# Altium schematic sheet Schematic.SchDoc
size 381 x 241 mm
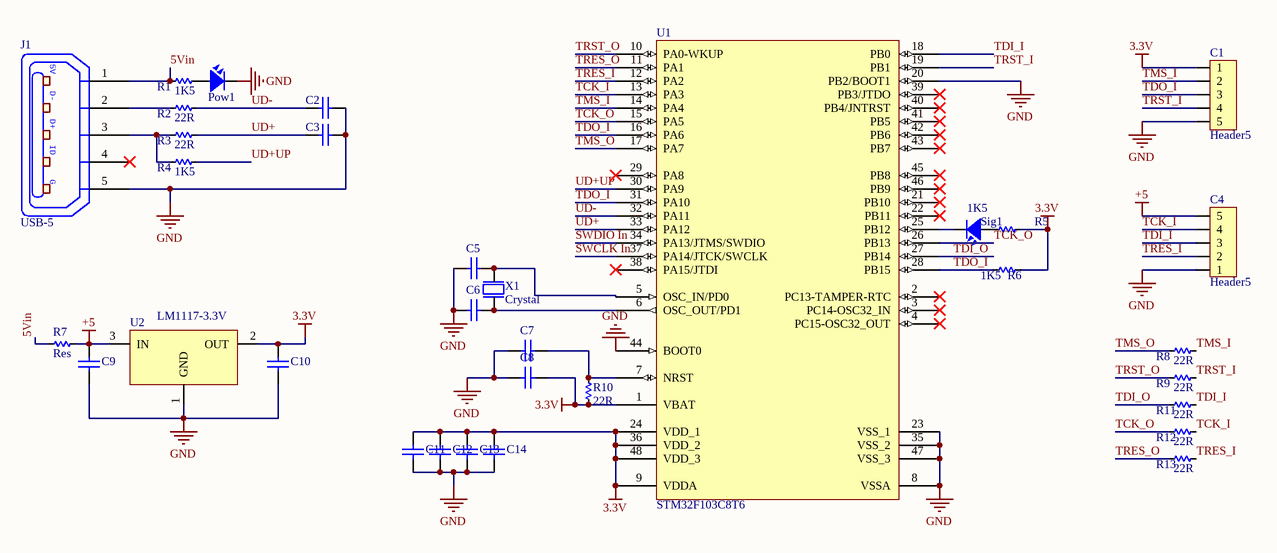
[diagram p0: Schematic.SchDoc]

## Parts
C1  Header5  [Header5 SMD]
C2  Capacitor Ceramic  [C0805]  (value not drawn)
C3  Capacitor Ceramic  [C0805]  (value not drawn)
C4  Header5  [Header5 SMD]
C5  Capacitor Ceramic  [C0805]  (value not drawn)
C6  Capacitor Ceramic  [C0805]  (value not drawn)
C7  Capacitor Ceramic  [C0805]  (value not drawn)
C8  Capacitor Ceramic  [C0805]  (value not drawn)
C9  Capacitor Ceramic  [C0805]  (value not drawn)
C10  Capacitor Ceramic  [C0805]  (value not drawn)
C11  Capacitor Ceramic  [C0805]  (value not drawn)
C12  Capacitor Ceramic  [C0805]  (value not drawn)
C13  Capacitor Ceramic  [C0805]  (value not drawn)
C14  Capacitor Ceramic  [C0805]  (value not drawn)
J1  USB-5  [USB-M1]
Pow1  LED  [LED-0805-Red]  (value not drawn)
R1  1K5  [RES-SMD-0603]
R2  22R  [RES-SMD-0603]
R3  22R  [RES-SMD-0603]
R4  1K5  [RES-SMD-0603]
R5  1K5  [RES-SMD-0603]
R6  1K5  [RES-SMD-0603]
R7  Res  [RES-SMD-1206]
R8  22R  [RES-SMD-0603]
R9  22R  [RES-SMD-0603]
R10  22R  [RES-SMD-0603]
R11  22R  [RES-SMD-0603]
R12  22R  [RES-SMD-0603]
R13  22R  [RES-SMD-0603]
Sig1  LED  [LED-0805-Red]  (value not drawn)
U1  STM32F103C8T6  [LQFP48_N]
U2  LM1117-3.3V  [SOT223]
X1  Crystal  [Crystal]

## Nets
3.3V: C1.1 C8.2 C10.1 C11.1 C12.1 C13.1 C14.1 R5.2 R6.2 R10.2 U1.1(VBAT) U1.9(VDDA) U1.24(VDD_1) U1.36(VDD_2) U1.48(VDD_3) U2.2(OUT)
+5: C4.5 C9.1 R7.1 U2.3(IN)
GND: C1.5 C2.1 C3.1 C4.1 C5.1 C6.1 C7.1 C8.1 C9.2 C10.2 C11.2 C12.2 C13.2 C14.2 J1.5(P5) Pow1.2 U1.8(VSSA) U1.20(PB2/BOOT1) U1.23(VSS_1) U1.35(VSS_2) U1.44(BOOT0) U1.47(VSS_3) U2.1(GND)
5Vin: J1.1(P1) R1.2 R7.2
SWCLK In: U1.37(PA14/JTCK/SWCLK)
SWDIO In: U1.34(PA13/JTMS/SWDIO)
TCK_I: C4.4 R12.1 U1.13(PA3)
TCK_O: R12.2 U1.15(PA5) U1.26(PB13)
TDI_I: C4.3 R11.1 U1.18(PB0)
TDI_O: R11.2 U1.27(PB14)
TDO_I: C1.3 R6.1 U1.16(PA6) U1.28(PB15) U1.31(PA10)
TMS_I: C1.2 R8.1 U1.14(PA4)
TMS_O: R8.2 U1.17(PA7)
TRES_I: C4.2 R13.1 U1.12(PA2)
TRES_O: R13.2 U1.11(PA1)
TRST_I: C1.4 R9.1 U1.19(PB1)
TRST_O: R9.2 U1.10(PA0-WKUP)
UD+: C3.2 R3.1 U1.33(PA12)
UD+UP: R4.1 U1.30(PA9)
UD-: C2.2 R2.1 U1.32(PA11)
NetC5_2: C5.2 U1.5(OSC_IN/PD0) X1.2
NetC6_2: C6.2 U1.6(OSC_OUT/PD1) X1.1
NetC7_2: C7.2 R10.1 U1.7(NRST)
NetJ1_2: J1.2(P2) R2.2
NetJ1_3: J1.3(P3) R3.2 R4.2
NetPow1_1: Pow1.1 R1.1
NetR5_1: R5.1 Sig1.1
NetSig1_2: Sig1.2 U1.25(PB12)

Not connected (* = marked no-connect by the designer): J1 4(P4)*; U1 2(PC13-TAMPER-RTC)* 3(PC14-OSC32_IN)* 4(PC15-OSC32_OUT)* 21(PB10)* 22(PB11)* 29(PA8)* 38(PA15/JTDI)* 39(PB3/JTDO)* 40(PB4/JNTRST)* 41(PB5)* 42(PB6)* 43(PB7)* 45(PB8)* 46(PB9)*

## Notes on the sheet
- (in symbol USB-5) 5V; D-; D+; ID; G

## Library data of the parts
C1 C4 = Header5: Header IDC, 5 x 1 Pin Vertical 2.54mm Pitch (Non-Boxed, Male); Manufacturer: W¨¹rth Elektronik eiSos GmbH; partNo: 613002143121; ComponentLink1 Description: Manufacturer; ComponentLink2 Description: Datasheet; NoPins: 02; Created Date: 29 March 2013; ComponentLink1URL: http://www.we-online.com; ComponentLink2URL: http://katalog.we-online.de/em/datasheet/6130xx143121.pdf; Created by: Karrer Zheng
C2 C3 C5-C14 = CapSMD: Capacitor; Value: 33p; Published: 8-Jun-2000; LatestRevisionDate: 17-Jul-2002; LatestRevisionNote: Re-released for DXP Platform.; PackageReference: RAD-0.3; Publisher: Altium Limited
J1 = USB-5: Manufacturer: FCI; Manufacturer Part Number: 10118193-0001LF; Connector Type: USB - micro B; Number of Contacts: 5; Gender: Receptacle; Specifications: USB 2.0; .Creator: MM; .Checked PCB: RF; Supplier 1: Digi-Key; RoHS: RoHS Compliant; Category: Connectors, Interconnects; Stock 1: 28642; Pricing 1: 1=0.46, 10=0.433, 25=0.3712, 50=0.3156, 100=0.3032, 250=0.27224, 500=0.25988 (USD); Packaging: Cut Tape (CT); Mounting Type: Surface Mount, Right Angle, Horizontal; Features: Shielded, Solder Retention; Ingress Protection: -; ComponentLink1URL: http://portal.fciconnect.com/Comergent//fci/drawing/10118193.pdf; ComponentLink1Description: http://portal.fciconnect.com/Comergent//fci/drawing/10118193.pdf; Supplier Part Number 1: 609-4616-1-ND; .Checked SCH: MM
Pow1 Sig1 = LED SMD: Value: LED 3 - 5 ly 2 Colour
R1-R13 = Res-SMD: Resistor; Manufacturer: Generic Components; Class: Passive; Published: 08/06/2000; Publisher: Altium Hobart Technology Centre
U1 = STM32F103C8T6: STM32 ARM-based 32-bit MCU with 64 Kbytes Flash, 48-pin LQFP, Industrial Temperature; Published: 30-May-2008; DatasheetVersion: rev6, Mar-2008; PackageVersion: Mar-2008; PackageReference: LQFP48; Publisher: Altium Limited; PackageDescription: 48-Pin Low-Profile Quad Flat Pack, 7 x 7 mm Body, 0.5 mm Pitch (LQFP48); ComponentLink1Description: Manufacturer Link; ComponentLink1URL: www.st.com/stm32; ComponentLink2Description: Datasheet; ComponentLink2URL: http://www.st.com/stonline/products/literature/ds/13587.pdf
U2 = LM1117: 800mA Low-Dropout Linear Regulator; Creator: Nguyen Ba Bien; Website: http://group3i.net